# Altium project CV-R-BAP_V2.1.5.PrjPcb
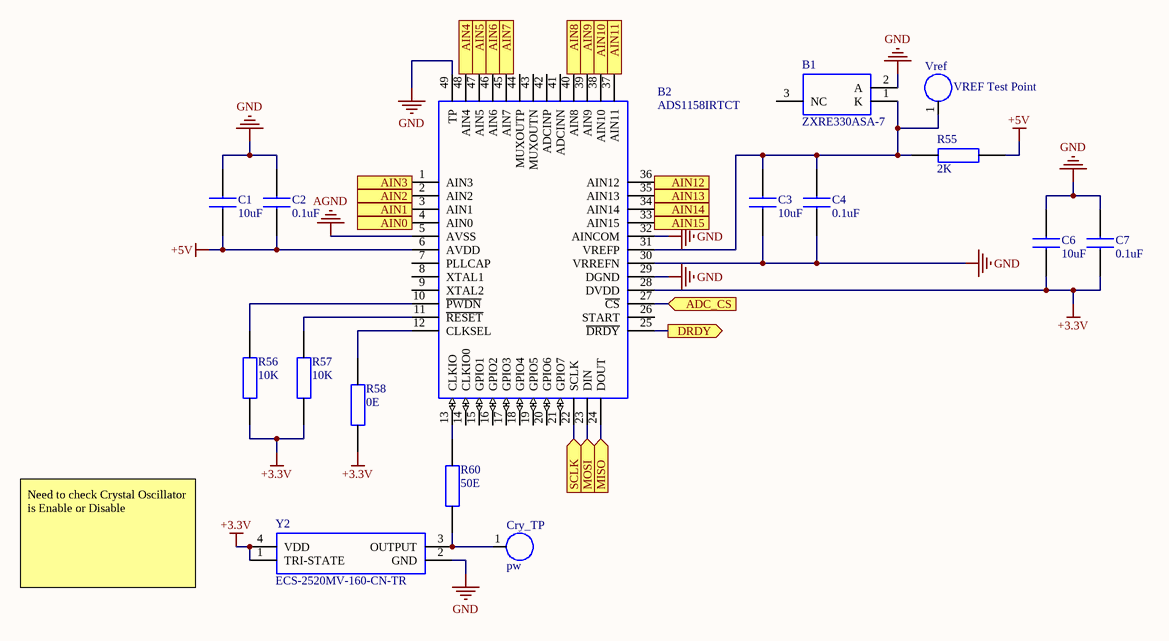
[diagram p0: ADS1158.SchDoc]
10 sheets, 156 parts. Net scope: flat (ports and power ports of the same name join across sheets).
Board file: CV-R-BAP_V2.1.5.PcbDoc
Sheets:
  ADS1158.SchDoc
  Edge_Slot_Interface.SchDoc
  CP2102.SchDoc
  ESP32.SchDoc
  External_Memory.SchDoc
  Power_Supply.SchDoc
  RTC.SchDoc
  LM334_Constant Current Source.SchDoc
  RFID_Reader.SchDoc
  Battery and ANT.SchDoc

## Sheet ADS1158.SchDoc
size A4

### Parts
B1  ZXRE330ASA-7  [SOT96P240X110-3N]
B2  ADS1158IRTCT  [QFN-48]
C1  10uF  [CAPC1608X80N]
C2  0.1uF  [CAPC1005X55N]
C3  10uF  [CAPC1608X80N]
C4  0.1uF  [CAPC1005X55N]
C6  10uF  [CAPC1608X80N]
C7  0.1uF  [CAPC1005X55N]
Cry_TP  pw  [Test Points]
R55  2K  [RESC1005X40N]
R56  10K  [RESC1005X40N]
R57  10K  [RESC1005X40N]
R58  0E  [RESC1005X40N]
R60  50E  [RESC1005X35N]
Vref  VREF Test Point  [Test Points]
Y2  ECS-2520MV-160-CN-TR  [ECS2520MV250BNTR]

### Ports
ADC_CS (in), AIN0 (in), AIN1 (in), AIN2 (in), AIN3 (in), AIN4 (in), AIN5 (in), AIN6 (in), AIN7 (in), AIN8 (in), AIN9 (in), AIN10 (in), AIN11 (in), AIN12 (in), AIN13 (in), AIN14 (in), AIN15 (in), DRDY (out), MISO (in), MOSI (in), SCLK (in)

### Nets
+3.3V: B2.28(DVDD) C6.1 C7.1 R56.1 R57.1 R58.1 Y2.1(TRI-STATE) Y2.4(VDD)
+5V: B2.6(AVDD) C1.1 C2.1 R55.2
AGND: B2.5(AVSS)
GND: B1.2(A) B2.29(DGND) B2.30(VRREFN) B2.32(AINCOM) B2.49(TP) C1.2 C2.2 C3.1 C4.1 C6.2 C7.2 Y2.2(GND)
NetB1_1: B1.1(K) B2.31(VREFP) C3.2 C4.2 R55.1 Vref.1
NetB2_1: B2.1(AIN3) ; port AIN3
NetB2_2: B2.2(AIN2) ; port AIN2
NetB2_3: B2.3(AIN1) ; port AIN1
NetB2_4: B2.4(AIN0) ; port AIN0
NetB2_10: B2.10(~{PWDN}) R56.2
NetB2_11: B2.11(~{RESET}) R57.2
NetB2_12: B2.12(CLKSEL) R58.2
NetB2_13: B2.13(CLKIO) R60.2
NetB2_22: B2.22(SCLK) ; port SCLK
NetB2_23: B2.23(DIN) ; port MOSI
NetB2_24: B2.24(DOUT) ; port MISO
NetB2_25: B2.25(~{DRDY}) ; port DRDY
NetB2_27: B2.27(~{CS}) ; port ADC_CS
NetB2_33: B2.33(AIN15) ; port AIN15
NetB2_34: B2.34(AIN14) ; port AIN14
NetB2_35: B2.35(AIN13) ; port AIN13
NetB2_36: B2.36(AIN12) ; port AIN12
NetB2_37: B2.37(AIN11) ; port AIN11
NetB2_38: B2.38(AIN10) ; port AIN10
NetB2_39: B2.39(AIN9) ; port AIN9
NetB2_40: B2.40(AIN8) ; port AIN8
NetB2_45: B2.45(AIN7) ; port AIN7
NetB2_46: B2.46(AIN6) ; port AIN6
NetB2_47: B2.47(AIN5) ; port AIN5
NetB2_48: B2.48(AIN4) ; port AIN4
NetCry_TP_1: Cry_TP.1 R60.1 Y2.3(OUTPUT)

Not connected (* = marked no-connect by the designer): B1 3(NC); B2 7(PLLCAP) 8(XTAL1) 9(XTAL2) 14(CLKIO0) 15(GPIO1) 16(GPIO2) 17(GPIO3) 18(GPIO4) 19(GPIO5) 20(GPIO6) 21(GPIO7) 26(START) 41(ADCINN) 42(ADCINP) 43(MUXOUTN) 44(MUXOUTP)

### Notes on the sheet
- Need to check Crystal Oscillator is Enable or Disable

### Library data of the parts
B1 = ZXRE330ASA-7: Diodes Inc ZXRE330ASA-7, Shunt Precision Voltage Reference 3.3V, +/-0.5%, 3-Pin SOT-23; Manufacturer_Name: Diodes Inc.; Geometry.Height: 1.1mm; Manufacturer_Part_Number: ZXRE330ASA-7; Arrow Part Number: ZXRE330ASA-7; Arrow Price/Stock: https://www.arrow.com/en/products/zxre330asa-7/diodes-incorporated; Mouser Part Number: 621-ZXRE330ASA-7; Mouser Price/Stock: https://www.mouser.co.uk/ProductDetail/Diodes-Incorporated/ZXRE330ASA-7?qs=4q%2FTN4Rqj6JkCriwoAvbDA%3D%3D; Datasheet Link: https://www.diodes.com/assets/Datasheets/ZXRE330.pdf
B2 = ADS1158IRTCT: 16-Bit, 125kSPS, 16-Ch Delta-Sigma ADC w/ Fast Channel Scan & Automatic Sequencer; Manufacturer_Name: Texas Instruments; Geometry.Height: 0.9mm; Manufacturer_Part_Number: ADS1158IRTCT; Arrow Part Number: ADS1158IRTCT; Arrow Price/Stock: https://www.arrow.com/en/products/ads1158irtct/texas-instruments; Mouser Part Number: 595-ADS1158IRTCT; Mouser Price/Stock: https://www.mouser.co.uk/ProductDetail/Texas-Instruments/ADS1158IRTCT?qs=Fn3VdHBzkcmocHRSn4DsYg%3D%3D; Datasheet Link: http://www.mouser.com/ds/2/405/ads1158-404657.pdf
C1 C3 C6 = C1608X5R1A106K080AC: TDK - C1608X5R1A106K080AC - CAP, MLCC, X5R, 10UF, 10V, 0603; Geometry.Height: 0.8mm; Manufacturer_Name: TDK; Manufacturer_Part_Number: C1608X5R1A106K080AC; Arrow Part Number: C1608X5R1A106K080AC; Arrow Price/Stock: https://www.arrow.com/en/products/c1608x5r1a106k080ac/tdk; Mouser Part Number: 810-C1608X5R1A106K; Mouser Price/Stock: https://www.mouser.co.uk/ProductDetail/TDK/C1608X5R1A106K080AC?qs=NRhsANhppD%252B2Bx3rv7OLbA%3D%3D; Datasheet Link: https://product.tdk.com/info/en/catalog/datasheets/mlcc_commercial_midvoltage_en.pdf
C2 C4 C7 = C0402C104M4RECTU: Multilayer Ceramic Capacitors MLCC - SMD/SMT 16V 0.1uF X7R 0402 20%; Manufacturer_Name: Kemet; Geometry.Height: 0.55mm; Manufacturer_Part_Number: C0402C104M4RECTU; Arrow Part Number: C0402C104M4RECTU; Arrow Price/Stock: *; Mouser Part Number: 80-C0402C104M4RECTU; Mouser Price/Stock: https://www.mouser.com/Search/Refine.aspx?Keyword=80-C0402C104M4RECTU; Datasheet Link: https://content.kemet.com/datasheets/KEM_C1002_X7R_SMD.pdf
Cry_TP Vref = Test Points
R55 = RC0402JR-072KL: RESISTOR, 0402 2K Ohms +/-5% 1/16 W; Manufacturer_Name: YAGEO (PHYCOMP); Geometry.Height: 0.4mm; Manufacturer_Part_Number: RC0402JR-072KL; Arrow Part Number: RC0402JR-072KL; Arrow Price/Stock: https://www.arrow.com/en/products/rc0402jr-072kl/yageo; Mouser Part Number: 603-RC0402JR-072KL; Mouser Price/Stock: https://www.mouser.com/Search/Refine.aspx?Keyword=603-RC0402JR-072KL; Datasheet Link: http://www.yageo.com/documents/recent/PYu-RC0402_51_RoHS_L_6_r.pdf
R56 R57 = CRCW040210K0FKED: CRCW0402 Resistor T/R 0.063W,1%,10K Vishay CRCW Series Thick Film Surface Mount Resistor 0402 Case 10k +/-1% 0.063W +/-100ppm/C; Geometry.Height: 0.4mm; Manufacturer_Name: Vishay; Manufacturer_Part_Number: CRCW040210K0FKED; Arrow Part Number: CRCW040210K0FKED; Arrow Price/Stock: https://www.arrow.com/en/products/crcw040210k0fked/vishay; Mouser Part Number: 71-CRCW0402-10K-E3; Mouser Price/Stock: https://www.mouser.co.uk/ProductDetail/Vishay-Dale/CRCW040210K0FKED?qs=rlE3Te1NifyN3e8vvxacSw%3D%3D; Datasheet Link: http://www.vishay.com/docs/20035/dcrcwe3.pdf
R58 = RC0402FR-070RL: Thick Film Resistors - SMD 0.0ohm 1%; Manufacturer_Name: YAGEO (PHYCOMP); Geometry.Height: 0.4mm; Manufacturer_Part_Number: RC0402FR-070RL; Arrow Part Number: RC0402FR-070RL; Arrow Price/Stock: https://www.arrow.com/en/products/rc0402fr-070rl/yageo; Mouser Part Number: 603-RC0402FR-070RL; Mouser Price/Stock: https://www.mouser.co.uk/ProductDetail/Yageo/RC0402FR-070RL?qs=sxZXDnvRBEhfSy4CZGX2ww%3D%3D; Datasheet Link: http://www.yageo.com/documents/recent/PYu-RC0402_51_RoHS_L_6_r.pdf
R60 = RT0402BRE0750RL: Thin Film Resistors - SMD 50 ohm 0.1% 50 ppm High-Precision; Manufacturer_Name: YAGEO (PHYCOMP); Geometry.Height: 0.35mm; Manufacturer_Part_Number: RT0402BRE0750RL; Arrow Part Number: RT0402BRE0750RL; Arrow Price/Stock: *; Mouser Part Number: 603-RT0402BRE0750RL; Mouser Price/Stock: https://www.mouser.com/Search/Refine.aspx?Keyword=603-RT0402BRE0750RL; Datasheet Link: https://componentsearchengine.com/Datasheets/1/RT0402BRE0750RL.pdf
Y2 = ECS-2520MV-160-CN-TR: Standard Clock Oscillators 16MHz 1.6-3.6 V 25ppm -40C +85C; Manufacturer_Name: ECS; Manufacturer_Part_Number: ECS-2520MV-160-CN-TR; Arrow Part Number: ECS-2520MV-160-CN-TR; Arrow Price/Stock: *; Mouser Part Number: 520-2520MV-160-CNT; Mouser Price/Stock: https://www.mouser.co.uk/ProductDetail/ECS/ECS-2520MV-160-CN-TR?qs=byeeYqUIh0MIhToPrW09tg%3D%3D; Datasheet Link: https://www.ecsxtal.com/store/pdf/ECS-2520MV.pdf

## Sheet Edge_Slot_Interface.SchDoc
size A4
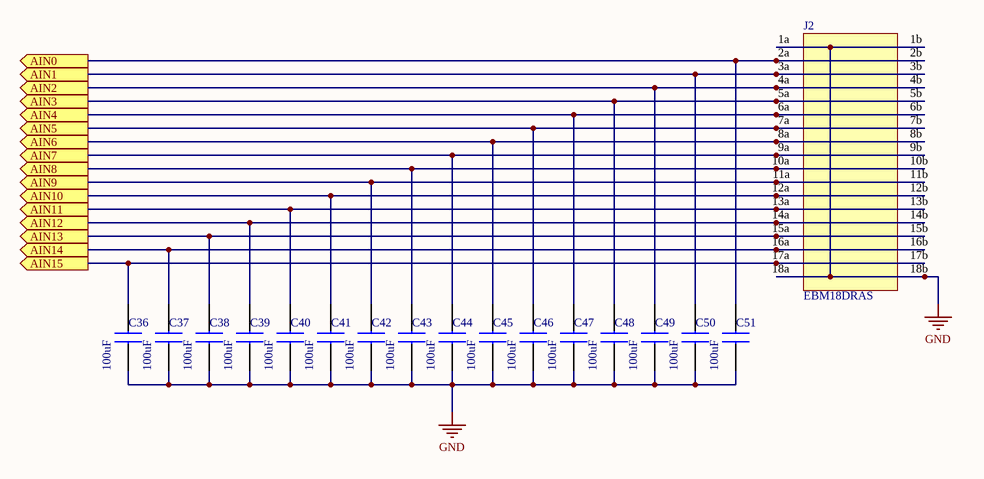
[diagram p1: Edge_Slot_Interface.SchDoc]

### Parts
C36  100uF  [Cap_0805]
C37  100uF  [Cap_0805]
C38  100uF  [Cap_0805]
C39  100uF  [Cap_0805]
C40  100uF  [Cap_0805]
C41  100uF  [Cap_0805]
C42  100uF  [Cap_0805]
C43  100uF  [Cap_0805]
C44  100uF  [Cap_0805]
C45  100uF  [Cap_0805]
C46  100uF  [Cap_0805]
C47  100uF  [Cap_0805]
C48  100uF  [Cap_0805]
C49  100uF  [Cap_0805]
C50  100uF  [Cap_0805]
C51  100uF  [Cap_0805]
J2  EBM18DRAS  [EBM18DRAS]

### Ports
AIN0 (out), AIN1 (out), AIN2 (out), AIN3 (out), AIN4 (out), AIN5 (out), AIN6 (out), AIN7 (out), AIN8 (out), AIN9 (out), AIN10 (out), AIN11 (out), AIN12 (out), AIN13 (out), AIN14 (out), AIN15 (out)

### Nets
GND: C36.1 C37.1 C38.1 C39.1 C40.1 C41.1 C42.1 C43.1 C44.1 C45.1 C46.1 C47.1 C48.1 C49.1 C50.1 C51.1 J2.1a J2.1b J2.18a J2.18b
NetB2_1: C48.2 J2.5a J2.5b ; port AIN3
NetB2_2: C49.2 J2.4a J2.4b ; port AIN2
NetB2_3: C50.2 J2.3a J2.3b ; port AIN1
NetB2_4: C51.2 J2.2a J2.2b ; port AIN0
NetB2_33: C36.2 J2.17a J2.17b ; port AIN15
NetB2_34: C37.2 J2.16a J2.16b ; port AIN14
NetB2_35: C38.2 J2.15a J2.15b ; port AIN13
NetB2_36: C39.2 J2.14a J2.14b ; port AIN12
NetB2_37: C40.2 J2.13a J2.13b ; port AIN11
NetB2_38: C41.2 J2.12a J2.12b ; port AIN10
NetB2_39: C42.2 J2.11a J2.11b ; port AIN9
NetB2_40: C43.2 J2.10a J2.10b ; port AIN8
NetB2_45: C44.2 J2.9a J2.9b ; port AIN7
NetB2_46: C45.2 J2.8a J2.8b ; port AIN6
NetB2_47: C46.2 J2.7a J2.7b ; port AIN5
NetB2_48: C47.2 J2.6a J2.6b ; port AIN4

### Library data of the parts
C36-C51 = VJ1206G106KXXTW1BC: Multilayer Ceramic Capacitors MLCC - SMD/SMT 10uF 25volts 10%; Manufacturer_Name: Vishay; Geometry.Height: 1.7mm; Manufacturer_Part_Number: VJ1206G106KXXTW1BC; Arrow Part Number: VJ1206G106KXXTW1BC; Arrow Price/Stock: *; Mouser Part Number: 77-VJ126G106KXXTW1BC; Mouser Price/Stock: https://www.mouser.co.uk/ProductDetail/Vishay-Vitramon/VJ1206G106KXXTW1BC?qs=%252BqhDFMvZazSFJ5Hhl5VYQw%3D%3D; Datasheet Link: http://www.vishay.com/docs/45200/vjhirelseries.pdf
J2 = EBM18DRAS: CONN EDGE DUAL FMALE 18POS 0.051mm dia

## Sheet CP2102.SchDoc
size A4
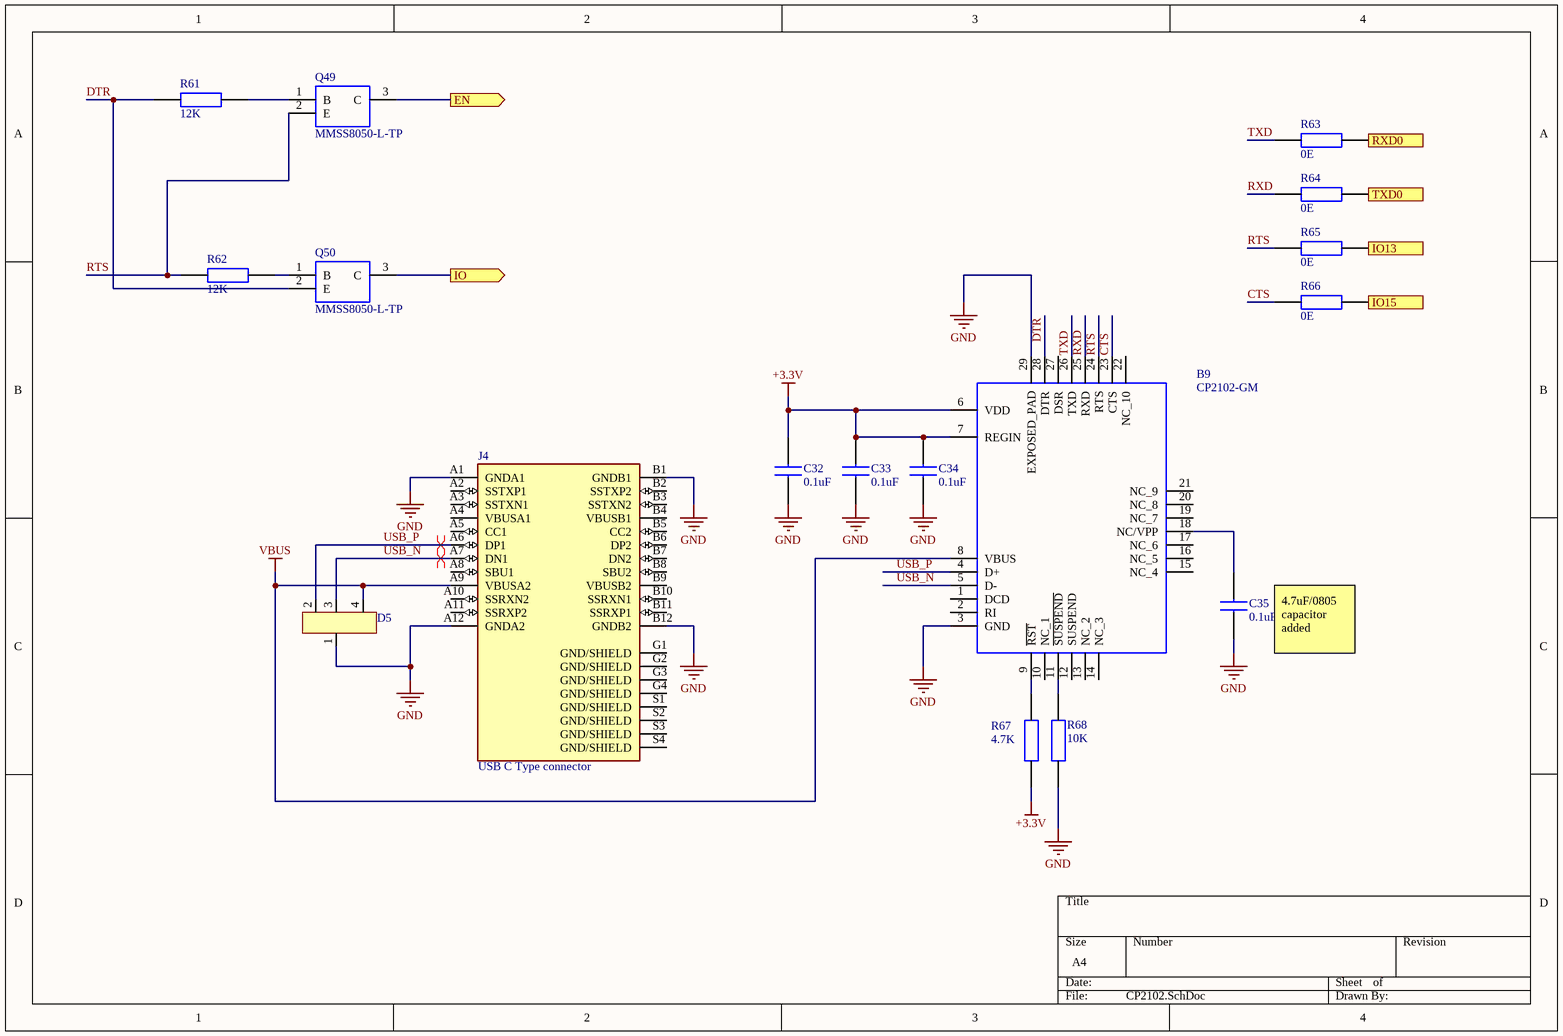
[diagram p2: CP2102.SchDoc]

### Parts
B9  CP2102-GM  [QFN-28]
C32  0.1uF  [CAPC1005X55N]
C33  0.1uF  [CAPC1005X55N]
C34  0.1uF  [CAPC1005X55N]
C35  0.1uF  [CAPC1005X55N]
D5  SP0504BAJTG_ESD Diode  [SOT-143-4]  (value not drawn)
J4  USB C Type connector  [USB C Type connector]
Q49  MMSS8050-L-TP  [SOT96P237X112-3N]
Q50  MMSS8050-L-TP  [SOT96P237X112-3N]
R61  12K  [RESC1005X40N]
R62  12K  [RESC1005X40N]
R63  0E  [RESC1005X40N]
R64  0E  [RESC1005X40N]
R65  0E  [RESC1005X40N]
R66  0E  [RESC1005X40N]
R67  4.7K  [RESC1005X40N]
R68  10K  [RESC1005X40N]

### Ports
EN (out), IO13 (out), IO15 (out), IO (out), RXD0 (out), TXD0 (in)

### Nets
+3.3V: B9.6(VDD) B9.7(REGIN) C32.2 C33.2 C34.2 R67.1
GND: B9.3(GND) B9.29(EXPOSED_PAD) C32.1 C33.1 C34.1 C35.1 D5.1 J4.A1(GNDA1) J4.A12(GNDA2) J4.B1(GNDB1) J4.B12(GNDB2) R68.1
VBUS: B9.8(VBUS) D5.4 J4.A9(VBUSA2)
CTS: B9.23(CTS) R66.1
DTR: B9.28(DTR) Q50.2(E) R61.1
RTS: B9.24(RTS) Q49.2(E) R62.1 R65.1
RXD: B9.25(RXD) R64.1
TXD: B9.26(TXD) R63.1
USB_N: B9.5(D-) D5.3 J4.A7(DN1)
USB_P: B9.4(D+) D5.2 J4.A6(DP1)
NetB4_3: Q49.3(C) ; port EN
NetB4_16: R65.2 ; port IO13
NetB4_23: R66.2 ; port IO15
NetB4_25: Q50.3(C) ; port IO
NetB4_34: R63.2 ; port RXD0
NetB4_35: R64.2 ; port TXD0
NetB9_9: B9.9(~{RST}) R67.2
NetB9_11: B9.11(~{SUSPEND}) R68.2
NetB9_18: B9.18(NC/VPP) C35.2
NetQ49_1: Q49.1(B) R61.2
NetQ50_1: Q50.1(B) R62.2

Not connected (* = marked no-connect by the designer): B9 1(DCD) 2(RI) 10(NC_1) 12(SUSPEND) 13(NC_2) 14(NC_3) 15(NC_4) 16(NC_5) 17(NC_6) 19(NC_7) 20(NC_8) 21(NC_9) 22(NC_10) 27(DSR); J4 A2(SSTXP1) A3(SSTXN1) A4(VBUSA1) A5(CC1) A8(SBU1) A10(SSRXN2) A11(SSRXP2) B2(SSTXP2) B3(SSTXN2) B4(VBUSB1) B5(CC2) B6(DP2) B7(DN2) B8(SBU2) B9(VBUSB2) B10(SSRXN1) B11(SSRXP1) G1(GND/SHIELD) G2(GND/SHIELD) G3(GND/SHIELD) G4(GND/SHIELD) S1(GND/SHIELD) S2(GND/SHIELD) S3(GND/SHIELD) S4(GND/SHIELD)

### Layout directives
differential pair: USB_N, USB_P

### Notes on the sheet
- (near C35) 4.7uF/0805 capacitor added

### Library data of the parts
B9 = CP2102-GM: CP2102-GM, USB Controller 12Mbit/s USB 2.0, 3.3 V, 28-Pin, QFN; Manufacturer_Name: Silicon Labs; Geometry.Height: 1mm; Manufacturer_Part_Number: CP2102-GM; Arrow Part Number: CP2102-GM; Arrow Price/Stock: https://www.arrow.com/en/products/cp2102-gm/silicon-labs; Mouser Part Number: 634-CP2102-GM; Mouser Price/Stock: https://www.mouser.co.uk/ProductDetail/Silicon-Labs/CP2102-GM?qs=yHCtFi5ROqJvCcyR88R4Pg%3D%3D; Datasheet Link: http://docs-emea.rs-online.com/webdocs/065a/0900766b8065a805.pdf
C32-C35 = C0402C104M4RECTU: Multilayer Ceramic Capacitors MLCC - SMD/SMT 16V 0.1uF X7R 0402 20%; Manufacturer: Kemet; Part Number: C0402C104M4RECTU; Mouser Link: *; F: *
D5 = SP0504BAJTG_ESD Diode: Part Number: SP0503BAHTG; Manufacturer: Little Fuse; Footprint Doc: SOT-143-4
J4 = USB C Type connector: Part Number: 632723100011
Q49 Q50 = MMSS8050-L-TP: Bipolar Transistors - BJT 625mW, 25V, 1500mA; Manufacturer_Name: Micro Commercial Components (MCC); Geometry.Height: 1.12mm; Manufacturer_Part_Number: MMSS8050-L-TP; Arrow Part Number: MMSS8050-L-TP; Arrow Price/Stock: https://www.arrow.com/en/products/mmss8050-l-tp/micro-commercial-components; Mouser Part Number: 833-MMSS8050-L-TP; Mouser Price/Stock: https://www.mouser.co.uk/ProductDetail/Micro-Commercial-Components-MCC/MMSS8050-L-TP?qs=FaVZESsvgnebflbaqJWJVQ%3D%3D; Datasheet Link: https://componentsearchengine.com/Datasheets/1/MMSS8050-L-TP.pdf
R61 R62 = RC0402FR-0712KL: RESISTOR, 0402 12K Ohms +/-1% 1/16 W; Manufacturer_Name: YAGEO (PHYCOMP); Geometry.Height: 0.4mm; Manufacturer_Part_Number: RC0402FR-0712KL; Arrow Part Number: RC0402FR-0712KL; Arrow Price/Stock: *; Mouser Part Number: 603-RC0402FR-0712KL; Mouser Price/Stock: https://www.mouser.com/Search/Refine.aspx?Keyword=603-RC0402FR-0712KL; Datasheet Link: http://www.yageo.com/documents/recent/PYu-RC0402_51_RoHS_L_6_r.pdf
R63-R66 = RC0402FR-070RL: as R58 on sheet ADS1158; Manufacturer_Part_Number: RC0402FR-070RL; Arrow Part Number: RC0402FR-070RL; Arrow Price/Stock: https://www.arrow.com/en/products/rc0402fr-070rl/yageo; Mouser Part Number: 603-RC0402FR-070RL; Mouser Price/Stock: https://www.mouser.co.uk/ProductDetail/Yageo/RC0402FR-070RL?qs=sxZXDnvRBEhfSy4CZGX2ww%3D%3D; Datasheet Link: http://www.yageo.com/documents/recent/PYu-RC0402_51_RoHS_L_6_r.pdf
R67 = RC0402FR-074K7L: YAGEO (PHYCOMP) - RC0402FR-074K7L - RES, THICK FILM, 4K7, 1%, 0.063W, 0402; Geometry.Height: 0.4mm; Manufacturer_Name: YAGEO (PHYCOMP); Manufacturer_Part_Number: RC0402FR-074K7L; Arrow Part Number: RC0402FR-074K7L; Arrow Price/Stock: https://www.arrow.com/en/products/rc0402fr-074k7l/yageo; Mouser Part Number: 603-RC0402FR-074K7L; Mouser Price/Stock: https://www.mouser.co.uk/ProductDetail/Yageo/RC0402FR-074K7L?qs=V1yeUXFNrkn%2FmCXC8N8TTA%3D%3D; Datasheet Link: http://www.yageo.com/documents/recent/PYu-RC0402_51_RoHS_L_6_r.pdf
R68 = RC0402JR-0710KL: YAGEO (PHYCOMP) - RC0402JR-0710KL - RES, THICK FILM, 10K, 5%, 0.0625W, 0402; Geometry.Height: 0.4mm; Manufacturer_Name: YAGEO (PHYCOMP); Manufacturer_Part_Number: RC0402JR-0710KL; Arrow Part Number: RC0402JR-0710KL; Arrow Price/Stock: *; Mouser Part Number: 603-RC0402JR-0710KL; Mouser Price/Stock: https://www.mouser.co.uk/ProductDetail/Yageo/RC0402JR-0710KL?qs=V1yeUXFNrkk4BhFptVo0Rw%3D%3D; Datasheet Link: http://www.yageo.com/documents/recent/PYu-RC0402_51_RoHS_L_6_r.pdf

## Sheet ESP32.SchDoc
size A4
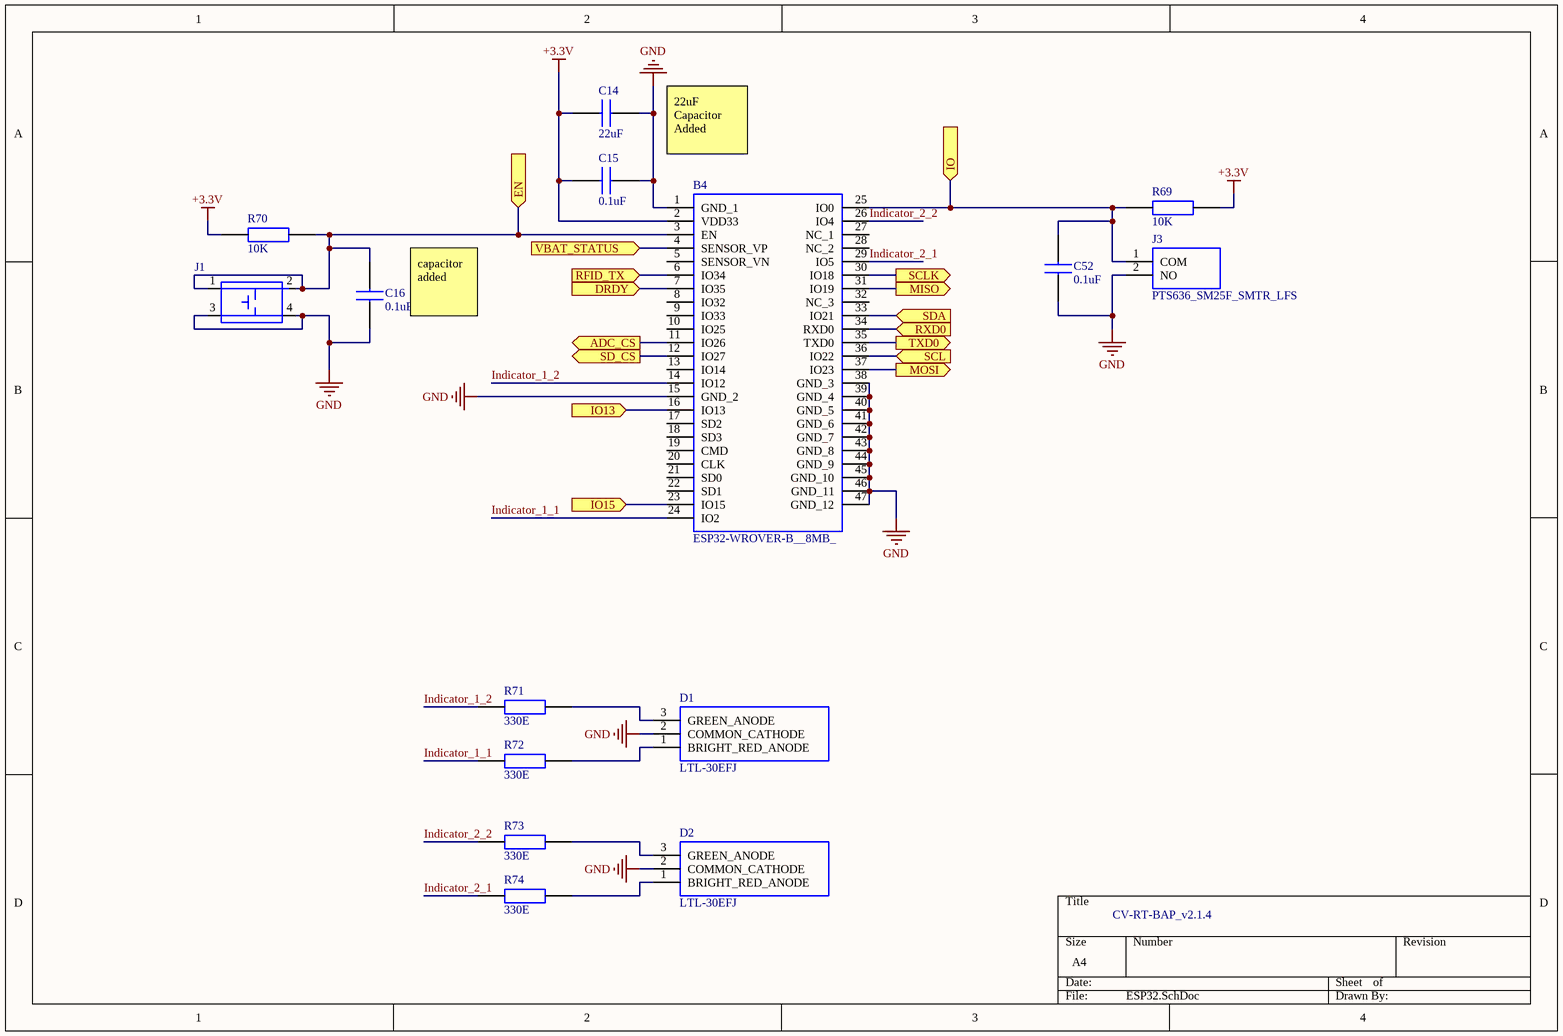
[diagram p3: ESP32.SchDoc]

### Parts
B4  ESP32-WROVER-B__8MB_  [ESP32WROVERB8MB]
C14  22uF  [CAPC3216X180N]
C15  0.1uF  [CAPC1005X55N]
C16  0.1uF  [CAPC1005X55N]
C52  0.1uF  [CAPC1005X55N]
D1  LTL-30EFJ  [LTL-30EHJ]
D2  LTL-30EFJ  [LTL-30EHJ]
J1  Tactile switch_TH  [Tactile switch_vertical]  (value not drawn)
J3  PTS636_SM25F_SMTR_LFS  [PTS636SM25FSMTRLFS]
R69  10K  [RESC1005X40N]
R70  10K  [RESC1005X40N]
R71  330E  [RESC1005X40N]
R72  330E  [RESC1005X40N]
R73  330E  [RESC1005X40N]
R74  330E  [RESC1005X40N]

### Ports
ADC_CS (out), DRDY (in), EN (in), IO13 (in), IO15 (in), IO (in), MISO (out), MOSI (out), RFID_TX (in), RXD0 (in), SCL (in), SCLK (out), SD_CS (out), SDA (in), TXD0 (out), VBAT_STATUS (in)

### Nets
+3.3V: B4.2(VDD33) C14.1 C15.1 R69.2 R70.1
GND: B4.1(GND_1) B4.15(GND_2) B4.38(GND_3) B4.39(GND_4) B4.40(GND_5) B4.41(GND_6) B4.42(GND_7) B4.43(GND_8) B4.44(GND_9) B4.45(GND_10) B4.46(GND_11) B4.47(GND_12) C14.2 C15.2 C16.1 C52.1 D1.2(COMMON_CATHODE) D2.2(COMMON_CATHODE) J1.3 J1.4 J3.2(NO)
Indicator_1_1: B4.24(IO2) R72.1
Indicator_1_2: B4.14(IO12) R71.1
Indicator_2_1: B4.29(IO5) R74.1
Indicator_2_2: B4.26(IO4) R73.1
NetB2_22: B4.30(IO18) ; port SCLK
NetB2_23: B4.37(IO23) ; port MOSI
NetB2_24: B4.31(IO19) ; port MISO
NetB2_25: B4.7(IO35) ; port DRDY
NetB2_27: B4.11(IO26) ; port ADC_CS
NetB3_5: B4.33(IO21) ; port SDA
NetB3_6: B4.36(IO22) ; port SCL
NetB4_3: B4.3(EN) C16.2 J1.1 J1.2 R70.2 ; port EN
NetB4_4: B4.4(SENSOR_VP) ; port VBAT_STATUS
NetB4_6: B4.6(IO34) ; port RFID_TX
NetB4_12: B4.12(IO27) ; port SD_CS
NetB4_16: B4.16(IO13) ; port IO13
NetB4_23: B4.23(IO15) ; port IO15
NetB4_25: B4.25(IO0) C52.2 J3.1(COM) R69.1 ; port IO
NetB4_34: B4.34(RXD0) ; port RXD0
NetB4_35: B4.35(TXD0) ; port TXD0
NetD1_1: D1.1(BRIGHT_RED_ANODE) R72.2
NetD1_3: D1.3(GREEN_ANODE) R71.2
NetD2_1: D2.1(BRIGHT_RED_ANODE) R74.2
NetD2_3: D2.3(GREEN_ANODE) R73.2

Not connected (* = marked no-connect by the designer): B4 5(SENSOR_VN) 8(IO32) 9(IO33) 10(IO25) 13(IO14) 17(SD2) 18(SD3) 19(CMD) 20(CLK) 21(SD0) 22(SD1) 27(NC_1) 28(NC_2) 32(NC_3)

### Notes on the sheet
- 22uF Capacitor Added
- (near C16) capacitor added
- CV-RT-BAP_v2.1.4

### Library data of the parts
B4 = ESP32-WROVER-B__8MB_: WiFi Modules (802.11) SMD Module M213DH6464PH3Q0, ESP32-D0WD, 64Mbits PSRAM, 8MB SPI flash, PCB Antenna; Manufacturer_Name: Espressif; Manufacturer_Part_Number: ESP32-WROVER-B (8MB); Geometry.Height: 3.4mm; Arrow Part Number: ESP32-WROVER-B (8MB); Arrow Price/Stock: *; Mouser Part Number: 356-ESP32-WRO-B(8MB); Mouser Price/Stock: *; Datasheet Link: https://eu.mouser.com/datasheet/2/891/esp32-wrover-b_datasheet_en-1384674.pdf
C14 = C0402C104M4RECTU: Multilayer Ceramic Capacitors MLCC - SMD/SMT 25V 22uF X7R 0402 20%; Manufacturer_Name: Kemet; Geometry.Height: 0.55mm; Manufacturer_Part_Number: C0402C104M4RECTU; Arrow Part Number: C0402C104M4RECTU; Arrow Price/Stock: *; Mouser Part Number: 80-C0402C104M4RECTU; Mouser Price/Stock: https://www.mouser.com/Search/Refine.aspx?Keyword=80-C0402C104M4RECTU; Datasheet Link: https://content.kemet.com/datasheets/KEM_C1002_X7R_SMD.pdf
C15 C16 C52 = C0402C104M4RECTU: as C2 on sheet ADS1158; Manufacturer_Part_Number: C0402C104M4RECTU; Arrow Part Number: C0402C104M4RECTU; Arrow Price/Stock: *; Mouser Part Number: 80-C0402C104M4RECTU; Mouser Price/Stock: https://www.mouser.com/Search/Refine.aspx?Keyword=80-C0402C104M4RECTU; Datasheet Link: https://content.kemet.com/datasheets/KEM_C1002_X7R_SMD.pdf
D1 D2 = LTL-30EFJ: Standard LEDs - Through Hole Red/Green Diffused; Manufacturer_Name: Lite-On; Manufacturer_Part_Number: LTL-30EFJ; Arrow Part Number: LTL-30EFJ; Arrow Price/Stock: https://www.arrow.com/en/products/ltl-30efj/lite-on-technology; Mouser Part Number: 859-LTL-30EFJ; Mouser Price/Stock: https://www.mouser.com/Search/Refine.aspx?Keyword=859-LTL-30EFJ; Datasheet Link: https://componentsearchengine.com/Datasheets/1/LTL-30EFJ.pdf
J1 = Tactile switch_TH: Part Number: SKHHANA010
J3 = PTS636_SM25F_SMTR_LFS: Tactile Switches Tact 50mA 12VDC, 6.0x3.5, 2.5mm H, 180gf, F leads, No ground pin, White Actuator; Manufacturer_Name: C & K COMPONENTS; Manufacturer_Part_Number: PTS636 SM25F SMTR LFS; Geometry.Height: 2.7mm; Arrow Part Number: PTS636 SM25F SMTR LFS; Arrow Price/Stock: https://www.arrow.com/en/products/pts636-sm25f-smtr-lfs/ck; Mouser Part Number: 611-PTS636SM25FSMTRL; Mouser Price/Stock: https://www.mouser.co.uk/ProductDetail/CK/PTS636-SM25F-SMTR-LFS?qs=vLWxofP3U2wcBTQSwfMFOw%3D%3D; Datasheet Link: https://ms.componentsearchengine.com/Datasheets/1/PTS636 SM25F SMTR LFS.pdf
R69 R70 = CRCW040210K0FKED: as R56 on sheet ADS1158; Manufacturer_Name: Vishay; Manufacturer_Part_Number: CRCW040210K0FKED; Arrow Part Number: CRCW040210K0FKED; Arrow Price/Stock: https://www.arrow.com/en/products/crcw040210k0fked/vishay; Mouser Part Number: 71-CRCW0402-10K-E3; Mouser Price/Stock: https://www.mouser.co.uk/ProductDetail/Vishay-Dale/CRCW040210K0FKED?qs=rlE3Te1NifyN3e8vvxacSw%3D%3D; Datasheet Link: http://www.vishay.com/docs/20035/dcrcwe3.pdf
R71-R74 = RC0402FR-07330RL: YAGEO (PHYCOMP) - RC0402FR-07330RL - RES, THICK FILM, 330R, 1%, 0.063W, 0402; Geometry.Height: 0.4mm; Manufacturer_Name: YAGEO (PHYCOMP); Manufacturer_Part_Number: RC0402FR-07330RL; Arrow Part Number: RC0402FR-07330RL; Arrow Price/Stock: https://www.arrow.com/en/products/rc0402fr-07330rl/yageo; Mouser Part Number: 603-RC0402FR-07330RL; Mouser Price/Stock: https://www.mouser.com/Search/Refine.aspx?Keyword=603-RC0402FR-07330RL; Datasheet Link: http://www.yageo.com/documents/recent/PYu-RC0402_51_RoHS_L_6_r.pdf

## Sheet External_Memory.SchDoc
size A4
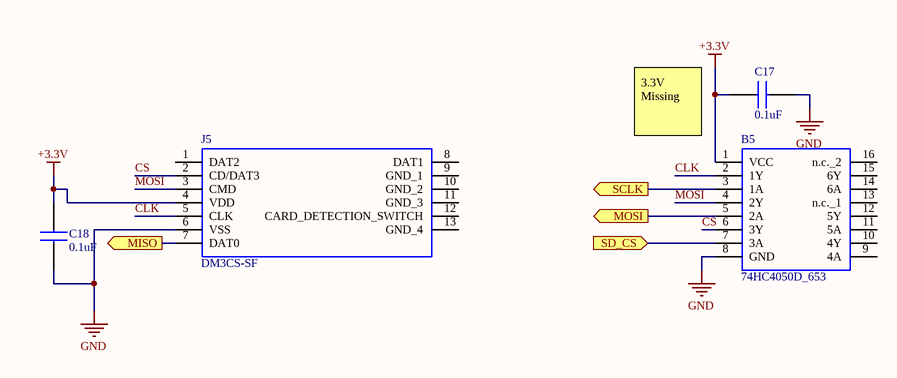
[diagram p4: External_Memory.SchDoc]

### Parts
B5  74HC4050D_653  [SOIC127P600X175-16N]
C17  0.1uF  [CAPC1005X55N]
C18  0.1uF  [CAPC1005X55N]
J5  DM3CS-SF  [DM3CS-SF]

### Ports
MISO (out), MOSI (out), SCLK (out), SD_CS (in)

### Nets
+3.3V: B5.1(VCC) C17.1 C18.2 J5.4(VDD)
GND: B5.8(GND) C17.2 C18.1 J5.6(VSS)
CLK: B5.2(1Y) J5.5(CLK)
CS: B5.6(3Y) J5.2(CD/DAT3)
MOSI: B5.4(2Y) J5.3(CMD)
NetB2_22: B5.3(1A) ; port SCLK
NetB2_23: B5.5(2A) ; port MOSI
NetB2_24: J5.7(DAT0) ; port MISO
NetB4_12: B5.7(3A) ; port SD_CS

Not connected (* = marked no-connect by the designer): B5 9(4A) 10(4Y) 11(5A) 12(5Y) 13(n.c._1) 14(6A) 15(6Y) 16(n.c._2); J5 1(DAT2) 8(DAT1) 9(GND_1) 10(GND_2) 11(GND_3) 12(CARD_DETECTION_SWITCH) 13(GND_4)

### Notes on the sheet
- 3.3V Missing

### Library data of the parts
B5 = 74HC4050D_653: 74HC4050 - Hex non-inverting HIGH-to-LOW level shifter@en-us; Manufacturer_Name: Nexperia; Manufacturer_Part_Number: 74HC4050D,653; Geometry.Height: 1.75mm; Arrow Part Number: 74HC4050D,653; Arrow Price/Stock: https://www.arrow.com/en/products/74hc4050d653/nexperia; Mouser Part Number: 771-74HC4050D-T; Mouser Price/Stock: https://www.mouser.co.uk/ProductDetail/Nexperia/74HC4050D653?qs=P62ublwmbi%2FIblpTHxAIPw%3D%3D; Datasheet Link: https://assets.nexperia.com/documents/data-sheet/74HC4050.pdf
C17 C18 = C0402C104M4RECTU: as C2 on sheet ADS1158; Manufacturer_Part_Number: C0402C104M4RECTU; Arrow Part Number: C0402C104M4RECTU; Arrow Price/Stock: *; Mouser Part Number: 80-C0402C104M4RECTU; Mouser Price/Stock: https://www.mouser.com/Search/Refine.aspx?Keyword=80-C0402C104M4RECTU; Datasheet Link: https://content.kemet.com/datasheets/KEM_C1002_X7R_SMD.pdf
J5 = DM3CS-SF: MicroSD card connector, push-pull type MicroSD card connector, push-pull type; Manufacturer_Name: Hirose; Manufacturer_Part_Number: DM3CS-SF; Arrow Part Number: DM3CS-SF; Arrow Price/Stock: https://www.arrow.com/en/products/dm3cs-sf/hirose-electric; Mouser Part Number: 798-DM3CSSF; Mouser Price/Stock: https://www.mouser.co.uk/ProductDetail/Hirose-Connector/DM3CS-SF?qs=tTj%252BmQ3KZwbB9K5zh89Rcw%3D%3D; Datasheet Link: http://docs-emea.rs-online.com/webdocs/118f/0900766b8118f8bb.pdf

## Sheet Power_Supply.SchDoc: Main_Board_v2.2_Power_Supply
size A4
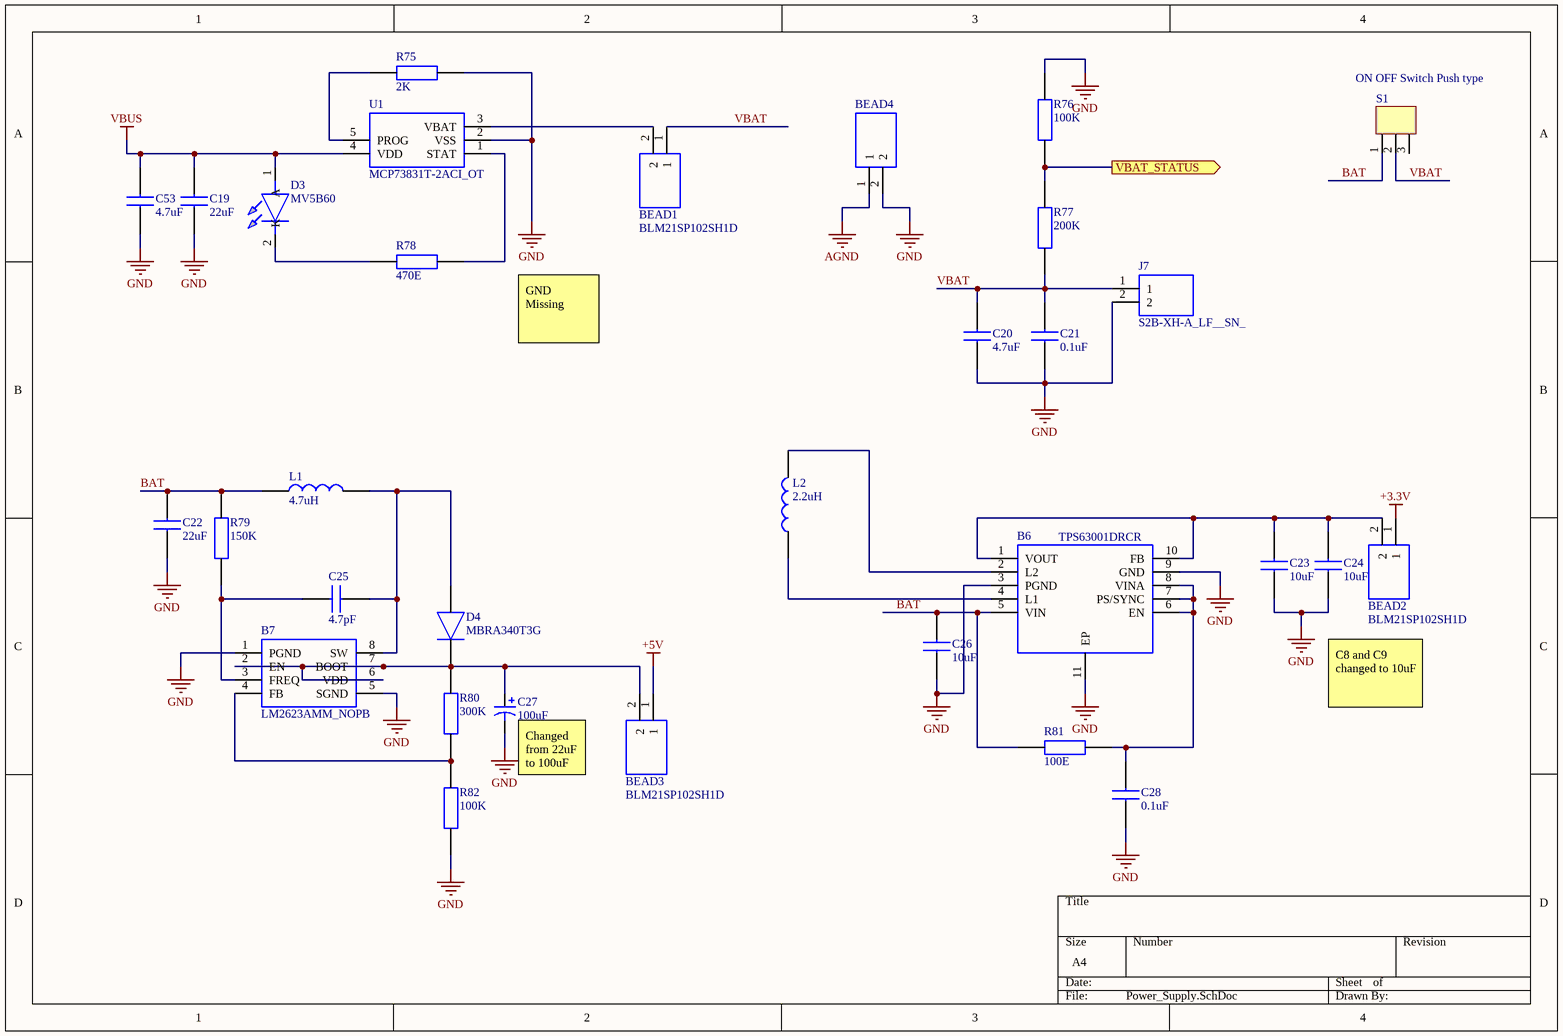
[diagram p5: Power_Supply.SchDoc]

### Parts
B6  TPS63001DRCR  [SON50P300X300X100-11N-D]
B7  LM2623AMM_NOPB  [SOP65P490X110-8N]
BEAD1  BLM21SP102SH1D  [Bead_0805]
BEAD2  BLM21SP102SH1D  [Bead_0805]
BEAD3  BLM21SP102SH1D  [Bead_0805]
BEAD4  BLM21SP102SH1D  [Bead_0805]  (value not drawn)
C19  22uF  [CAPC3216X180N]
C20  4.7uF  [CAPC2012X140N]
C21  0.1uF  [CAPC1005X55N]
C22  22uF  [CAPC3216X180N]
C23  10uF  [CAPC1608X80N]
C24  10uF  [CAPC1608X80N]
C25  4.7pF  [CAPC2012X88N]
C26  10uF  [CAPC3216X170N]
C27  value 100uF  [Tantalum Capacitor_2917]  (hidden comment: Cap Pol1)
C28  0.1uF  [CAPC1005X55N]
C53  4.7uF  [CAPC2012X140N]
D3  MV5B60  [MV5B60]
D4  MBRA340T3G  [DIOM5226X220N]
J7  S2B-XH-A_LF__SN_  [SHDRRA2W80P0X250_1X2_740X1150X610P]
L1  4.7uH  [INDC2012X140N]
L2  2.2uH  [INDC2012X140N]
R75  2K  [RESC1005X40N]
R76  100K  [RESC2012X60N]
R77  200K  [RESC2012X60N]
R78  470E  [RESC1005X40N]
R79  150K  [RESC2012X50N]
R80  300K  [RESC1005X40N]
R81  100E  [RESC1005X40N]
R82  100K  [RESC1005X40N]
S1  ON OFF Switch Push type  [SPST_Push type]
U1  MCP73831T-2ACI_OT  [SOT95P270X145-5N]

### Ports
VBAT_STATUS (out)

### Nets
+3.3V: BEAD2.1
+5V: BEAD3.1
AGND: BEAD4.1
GND: B6.3(PGND) B6.9(GND) B6.11(EP) B7.1(PGND) B7.5(SGND) BEAD4.2 C19.1 C20.1 C21.1 C22.1 C23.1 C24.1 C26.1 C27.2 C28.1 C53.1 J7.2 R75.2 R76.2 R82.1 U1.2(VSS)
VBUS: C19.2 C53.2 D3.1(A) U1.4(VDD)
BAT: B6.5(VIN) C22.2 C26.2 L1.1 R79.2 R81.2 S1.1
VBAT: BEAD1.1 C20.2 C21.2 J7.1 R77.1 S1.2
NetB4_4: R76.1 R77.2 ; port VBAT_STATUS
NetB6_1: B6.1(VOUT) B6.10(FB) BEAD2.2 C23.2 C24.2
NetB6_2: B6.2(L2) L2.2
NetB6_4: B6.4(L1) L2.1
NetB6_6: B6.6(EN) B6.7(PS/SYNC) B6.8(VINA) C28.2 R81.1
NetB7_2: B7.2(EN) B7.6(VDD) B7.7(BOOT) BEAD3.2 C27.1 D4.1(K) R80.2
NetB7_3: B7.3(FREQ) C25.1 R79.1
NetB7_4: B7.4(FB) R80.1 R82.2
NetB7_8: B7.8(SW) C25.2 D4.2(A) L1.2
NetBEAD1_2: BEAD1.2 U1.3(VBAT)
NetD3_2: D3.2(K) R78.2
NetR75_1: R75.1 U1.5(PROG)
NetR78_1: R78.1 U1.1(STAT)

Not connected (* = marked no-connect by the designer): S1 3

### Notes on the sheet
- GND  Missing
- C8 and C9 changed to 10uF
- (near C27) Changed from 22uF to 100uF Tantulum cap

### Library data of the parts
B6 = TPS63001DRCR: 96% Buck-Boost Converter with 1.7A Current Switches, 3.3V fixed Output voltage in 3x3 QFN; Manufacturer_Name: Texas Instruments; Geometry.Height: 1mm; Manufacturer_Part_Number: TPS63001DRCR; Arrow Part Number: TPS63001DRCR; Arrow Price/Stock: https://www.arrow.com/en/products/tps63001drcr/texas-instruments; Mouser Part Number: 595-TPS63001DRCR; Mouser Price/Stock: https://www.mouser.co.uk/ProductDetail/Texas-Instruments/TPS63001DRCR?qs=QZuYiDxzHagn01UZf%2F%252B1Bw%3D%3D; Datasheet Link: http://www.ti.com/lit/gpn/tps63001
B7 = LM2623AMM_NOPB: General Purpose, Gated Oscillator Based, DC/DC Boost Converter; Manufacturer_Name: Texas Instruments; Manufacturer_Part_Number: LM2623AMM/NOPB; Geometry.Height: 1.1mm; Arrow Part Number: LM2623AMM/NOPB; Arrow Price/Stock: https://www.arrow.com/en/products/lm2623ammnopb/texas-instruments; Mouser Part Number: 926-LM2623AMM/NOPB; Mouser Price/Stock: https://www.mouser.co.uk/ProductDetail/Texas-Instruments/LM2623AMM-NOPB?qs=X1J7HmVL2ZHUXFRmS%252BHhFg%3D%3D; Datasheet Link: http://www.ti.com/lit/ds/symlink/lm2623.pdf
BEAD1-BEAD4 = BLM21SP102SH1D: BLM21_H1D Series EMI Suppression Filter 1000+/-25% at 100MHz 1.6A @85; Manufacturer_Name: Murata Electronics; Geometry.Height: 1.05mm; Manufacturer_Part_Number: BLM21SP102SH1D; Arrow Part Number: BLM21SP102SH1D; Arrow Price/Stock: https://www.arrow.com/en/products/blm21sp102sh1d/murata-manufacturing; Mouser Part Number: 81-BLM21SP102SH1D; Mouser Price/Stock: https://www.mouser.co.uk/ProductDetail/Murata-Electronics/BLM21SP102SH1D?qs=17u8i%2FzlE88gxwLak368hw%3D%3D; Datasheet Link: https://www.murata.com/en-us/products/productdetail?partno=BLM21SP102SH1%23
C19 C22 = CC1206KKX7R6BB226: Multilayer Ceramic Capacitors MLCC - SMD/SMT 22uF 10% 10V; Manufacturer_Name: YAGEO (PHYCOMP); Geometry.Height: 1.8mm; Manufacturer_Part_Number: CC1206KKX7R6BB226; Arrow Part Number: CC1206KKX7R6BB226; Arrow Price/Stock: *; Mouser Part Number: 603-CC206KKX7R6BB226; Mouser Price/Stock: https://www.mouser.com/Search/Refine.aspx?Keyword=603-CC206KKX7R6BB226; Datasheet Link: https://www.mouser.com/datasheet/2/447/UPY-GPHC_X7R_6.3V-to-50V_18-1154002.pdf
C20 C53 = C0805C475J9RACAUTO: KEMET 0805 (2012M) 4.7uF MLCC 6.3V dc +/-5% SMD C0805C475J9RACAUTO; Geometry.Height: 1.4mm; Manufacturer_Name: Kemet; Manufacturer_Part_Number: C0805C475J9RACAUTO; Arrow Part Number: C0805C475J9RACAUTO; Arrow Price/Stock: https://www.arrow.com/en/products/c0805c475j9racauto/kemet-corporation; Mouser Part Number: 80-C0805C475J9RAUTO; Mouser Price/Stock: https://www.mouser.com/Search/Refine.aspx?Keyword=80-C0805C475J9RAUTO; Datasheet Link: https://api.kemet.com/component-edge/download/datasheet/C0805C475J9RACAUTO.pdf
C21 C28 = C0402C104M4RECTU: as C2 on sheet ADS1158; Manufacturer_Part_Number: C0402C104M4RECTU; Arrow Part Number: C0402C104M4RECTU; Arrow Price/Stock: *; Mouser Part Number: 80-C0402C104M4RECTU; Mouser Price/Stock: https://www.mouser.com/Search/Refine.aspx?Keyword=80-C0402C104M4RECTU; Datasheet Link: https://content.kemet.com/datasheets/KEM_C1002_X7R_SMD.pdf
C23 = C0402C104M4RECTU: CAP TANT 10UF 10% 6.3V 1206; Manufacturer_Name: Kemet; Manufacturer_Part_Number: 293D106X96R3A2TE3; Geometry.Height: 0.55mm; Arrow Part Number: C0402C104M4RECTU; Arrow Price/Stock: *; Mouser Part Number: 80-C0402C104M4RECTU; Mouser Price/Stock: https://www.mouser.com/Search/Refine.aspx?Keyword=80-C0402C104M4RECTU; Datasheet Link: https://content.kemet.com/datasheets/KEM_C1002_X7R_SMD.pdf
C24 = CC1206KKX7R6BB226: CAP TANT 10UF 10% 6.3V 1206; Manufacturer_Name: YAGEO (PHYCOMP); Manufacturer_Part_Number: 293D106X96R3A2TE3; Geometry.Height: 1.8mm; Arrow Part Number: CC1206KKX7R6BB226; Arrow Price/Stock: *; Mouser Part Number: 603-CC206KKX7R6BB226; Mouser Price/Stock: https://www.mouser.com/Search/Refine.aspx?Keyword=603-CC206KKX7R6BB226; Datasheet Link: https://www.mouser.com/datasheet/2/447/UPY-GPHC_X7R_6.3V-to-50V_18-1154002.pdf
C25 = C0805C479C2GACTU: Kemet 0805 C 4.7pF Ceramic Multilayer Capacitor, 200 V dc, +125C, C0G Dielectric, +/-0.25pF; Geometry.Height: 0.88mm; Manufacturer_Name: Kemet; Manufacturer_Part_Number: C0805C479C2GACTU; Arrow Part Number: C0805C479C2GACTU; Arrow Price/Stock: *; Mouser Part Number: 80-C0805C479C2G; Mouser Price/Stock: https://www.mouser.co.uk/ProductDetail/KEMET/C0805C479C2GACTU?qs=Kt%252B%2Fw7aCTnl%2FOadhisFOJw%3D%3D; Datasheet Link: https://search.kemet.com/component-edge/download/specsheet/C0805C479C2GACTU.pdf
C26 = VJ1206G106KXXTW1BC: as C36 on sheet Edge_Slot_Interface; Manufacturer_Part_Number: VJ1206G106KXXTW1BC; Arrow Part Number: VJ1206G106KXXTW1BC; Arrow Price/Stock: *; Mouser Part Number: 77-VJ126G106KXXTW1BC; Mouser Price/Stock: https://www.mouser.co.uk/ProductDetail/Vishay-Vitramon/VJ1206G106KXXTW1BC?qs=%252BqhDFMvZazSFJ5Hhl5VYQw%3D%3D; Datasheet Link: http://www.vishay.com/docs/45200/vjhirelseries.pdf
C27 = Cap Pol1: Polarized Capacitor (Radial); Published: 8-Jun-2000; LatestRevisionDate: 17-Jul-2002; LatestRevisionNote: Re-released for DXP Platform.; PackageReference: RB7.6-15; Publisher: Altium Limited; PackageDescription: Polarized Capacitor (Radial); 2 Leads
D3 = MV5B60: Standard LEDs - Through Hole T-100 BLUE CLEAR; Manufacturer_Name: Everlight; Manufacturer_Part_Number: MV5B60; Arrow Part Number: MV5B60; Arrow Price/Stock: *; Mouser Part Number: 638-MV5B60; Mouser Price/Stock: https://www.mouser.com/Search/Refine.aspx?Keyword=638-MV5B60; Datasheet Link: https://componentsearchengine.com/Datasheets/1/MV5B60.pdf
D4 = MBRA340T3G: MBRA340T3G, Schottky Diode,  3A max, 40V, 2-Pin, SMA; Manufacturer_Name: ON Semiconductor; Geometry.Height: 2.2mm; Manufacturer_Part_Number: MBRA340T3G; Arrow Part Number: MBRA340T3G; Arrow Price/Stock: https://www.arrow.com/en/products/mbra340t3g/on-semiconductor; Mouser Part Number: 863-MBRA340T3G; Mouser Price/Stock: https://www.mouser.co.uk/ProductDetail/ON-Semiconductor/MBRA340T3G?qs=3JMERSakebq0pjb145uRLw%3D%3D; Datasheet Link: http://www.onsemi.com/pub/Collateral/MBRA340T3-D.PDF
J7 = S2B-XH-A_LF__SN_: XH-2.5mm Header side entry 2 way JST XH Series, Series Number S2B, 2.5mm Pitch 2 Way 1 Row Right Angle PCB Header, Solder Termination, 3A; Manufacturer_Name: JST (JAPAN SOLDERLESS TERMINALS); Manufacturer_Part_Number: S2B-XH-A(LF)(SN); Geometry.Height: 6.1mm; Arrow Part Number: S2B-XH-A(LF)(SN); Arrow Price/Stock: https://www.arrow.com/en/products/s2b-xh-a-lf-sn/jst-manufacturing; Mouser Part Number: *; Mouser Price/Stock: *; Datasheet Link: http://www.jst-mfg.com/product/pdf/eng/eXH.pdf
L1 L2 = BRC2012T2R2MD: Manufacturer_Name: TAIYO YUDEN; Geometry.Height: 1.4mm; Manufacturer_Part_Number: BRC2012T2R2MD; Arrow Part Number: BRC2012T2R2MD; Arrow Price/Stock: http://www.arrow.com/en/products/brc2012t2r2md/taiyo-yuden; Mouser Part Number: 963-BRC2012T2R2MD; Mouser Price/Stock: https://www.mouser.co.uk/ProductDetail/Taiyo-Yuden/BRC2012T2R2MD?qs=I6KAKw0tg2xahQxcAJDRXw%3D%3D; Datasheet Link: https://www.mouser.com/datasheet/2/396/wound07_e-1628381.pdf
R75 = RC0402JR-072KL: as R55 on sheet ADS1158; Manufacturer_Part_Number: RC0402JR-072KL; Arrow Part Number: RC0402JR-072KL; Arrow Price/Stock: https://www.arrow.com/en/products/rc0402jr-072kl/yageo; Mouser Part Number: 603-RC0402JR-072KL; Mouser Price/Stock: https://www.mouser.com/Search/Refine.aspx?Keyword=603-RC0402JR-072KL; Datasheet Link: http://www.yageo.com/documents/recent/PYu-RC0402_51_RoHS_L_6_r.pdf
R76 = RC0805JR-072ML: Thick Film Resistors - SMD 2M OHM 5%; Manufacturer_Name: YAGEO (PHYCOMP); Geometry.Height: 0.6mm; Manufacturer_Part_Number: RC0805JR-072ML; Arrow Part Number: RC0805JR-072ML; Arrow Price/Stock: https://www.arrow.com/en/products/rc0805jr-072ml/yageo; Mouser Part Number: 603-RC0805JR-072ML; Mouser Price/Stock: https://www.mouser.com/Search/Refine.aspx?Keyword=603-RC0805JR-072ML; Datasheet Link: http://www.yageo.com/documents/recent/PYu-RC_Group_51_RoHS_L_10.pdf
R77 = RC0805FR-07806KL: Thick Film Resistors - SMD 806K OHM 1%; Manufacturer_Name: YAGEO (PHYCOMP); Geometry.Height: 0.6mm; Manufacturer_Part_Number: RC0805FR-07806KL; Arrow Part Number: RC0805FR-07806KL; Arrow Price/Stock: https://www.arrow.com/en/products/rc0805fr-07806kl/yageo; Mouser Part Number: 603-RC0805FR-07806KL; Mouser Price/Stock: https://www.mouser.com/Search/Refine.aspx?Keyword=603-RC0805FR-07806KL; Datasheet Link: http://www.yageo.com/documents/recent/PYu-RC_Group_51_RoHS_L_10.pdf
R78 = RC0402JR-13470RL: Thick Film Resistors - SMD 470 ohm 5% 50V General Purpose; Manufacturer_Name: YAGEO (PHYCOMP); Geometry.Height: 0.4mm; Manufacturer_Part_Number: RC0402JR-13470RL; Arrow Part Number: RC0402JR-13470RL; Arrow Price/Stock: https://www.arrow.com/en/products/rc0402jr-13470rl/yageo; Mouser Part Number: 603-RC0402JR-13470RL; Mouser Price/Stock: https://www.mouser.co.uk/ProductDetail/Yageo/RC0402JR-13470RL?qs=fPU49sp6fCK89krzeMh7Zw%3D%3D; Datasheet Link: http://www.yageo.com/documents/recent/PYu-RC0402_51_RoHS_L_6_r.pdf
R79 = CRCW0805150KDKTA: Thick Film Resistors - SMD 1/8watt 150Kohms .5%; Manufacturer_Name: Vishay; Geometry.Height: 0.5mm; Manufacturer_Part_Number: CRCW0805150KDKTA; Arrow Part Number: CRCW0805150KDKTA; Arrow Price/Stock: *; Mouser Part Number: 71-CRCW08051503DT; Mouser Price/Stock: *; Datasheet Link: http://www.vishay.com/docs/20035/dcrcwe3.pdf
R80 = RC0402JR-07300KL: Thick Film Resistors - SMD 300K Ohm 5% 1/16W 50 Volts; Manufacturer_Name: YAGEO (PHYCOMP); Geometry.Height: 0.4mm; Manufacturer_Part_Number: RC0402JR-07300KL; Arrow Part Number: RC0402JR-07300KL; Arrow Price/Stock: *; Mouser Part Number: 603-RC0402JR-07300KL; Mouser Price/Stock: https://www.mouser.com/Search/Refine.aspx?Keyword=603-RC0402JR-07300KL; Datasheet Link: http://www.yageo.com/documents/recent/PYu-RC0402_51_RoHS_L_6_r.pdf
R81 = RC0402FR-07100RL: YAGEO (PHYCOMP) - RC0402FR-07100RL - RES, THICK FILM, 100R, 1%, 0.0625W, 0402; Geometry.Height: 0.4mm; Manufacturer_Name: YAGEO (PHYCOMP); Manufacturer_Part_Number: RC0402FR-07100RL; Arrow Part Number: RC0402FR-07100RL; Arrow Price/Stock: https://www.arrow.com/en/products/rc0402fr-07100rl/yageo; Mouser Part Number: 603-RC0402FR-07100RL; Mouser Price/Stock: https://www.mouser.co.uk/ProductDetail/Yageo/RC0402FR-07100RL?qs=V1yeUXFNrknwaJOOZ4yDtg%3D%3D; Datasheet Link: http://www.yageo.com/documents/recent/PYu-RC0402_51_RoHS_L_6_r.pdf
R82 = RCG0402100KFKED: Thick Film Resistors - SMD .063watt 100kohms 1% 0402 100ppm; Manufacturer_Name: Vishay; Geometry.Height: 0.4mm; Manufacturer_Part_Number: RCG0402100KFKED; Arrow Part Number: RCG0402100KFKED; Arrow Price/Stock: *; Mouser Part Number: 71-RCG0402100KFKED; Mouser Price/Stock: https://www.mouser.com/Search/Refine.aspx?Keyword=71-RCG0402100KFKED; Datasheet Link: http://www.vishay.com/docs/20037/rcae3.pdf
S1 = ON OFF Switch Push type: Part Number: PN12SHNA03QE
U1 = MCP73831T-2ACI_OT: Li-Ion Charge Controller 4.2V SOT23-5; Manufacturer_Name: Microchip; Manufacturer_Part_Number: MCP73831T-2ACI/OT; Geometry.Height: 1.45mm; Arrow Part Number: MCP73831T-2ACI/OT; Arrow Price/Stock: https://www.arrow.com/en/products/mcp73831t-2aciot/microchip-technology; Mouser Part Number: 579-MCP73831T-2ACIOT; Mouser Price/Stock: https://www.mouser.co.uk/ProductDetail/Microchip-Technology/MCP73831T-2ACI-OT?qs=yUQqVecv4qvbBQBGbHx0Mw%3D%3D; Datasheet Link: http://ww1.microchip.com/downloads/en/DeviceDoc/20001984g.pdf

## Sheet RTC.SchDoc
size A4
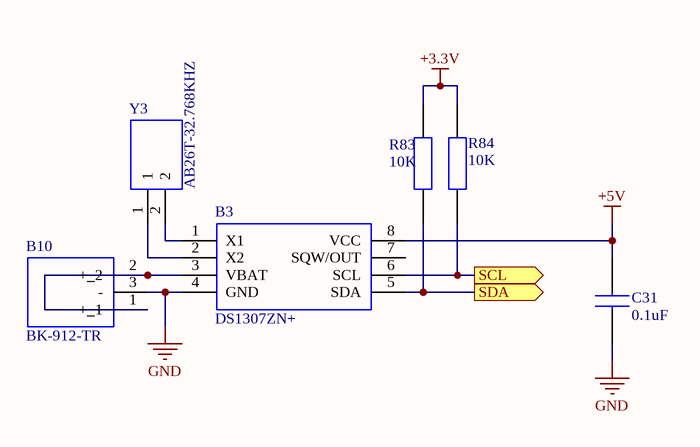
[diagram p6: RTC.SchDoc]

### Parts
B3  DS1307ZN+  [SOIC127P600X175-8N]
B10  BK-912-TR  [BK912TR]
C31  0.1uF  [CAPC1005X55N]
R83  10K  [RESC1005X40N]
R84  10K  [RESC1005X40N]
Y3  AB26T-32.768KHZ  [AB26T]

### Ports
SCL (out), SDA (out)

### Nets
+3.3V: R83.2 R84.2
+5V: B3.8(VCC) C31.2
GND: B3.4(GND) B10.3(-) C31.1
NetB3_1: B3.1(X1) Y3.2
NetB3_2: B3.2(X2) Y3.1
NetB3_3: B3.3(VBAT) B10.1(+_1) B10.2(+_2)
NetB3_5: B3.5(SDA) R83.1 ; port SDA
NetB3_6: B3.6(SCL) R84.1 ; port SCL

Not connected (* = marked no-connect by the designer): B3 7(SQW/OUT)

### Library data of the parts
B3 = DS1307ZN+: DS1307ZN+, Real Time Clock, Calendar, Clock, 56B RAM, I2C, 8-Pin SOIC; Manufacturer_Name: Maxim Integrated; Geometry.Height: 1.75mm; Manufacturer_Part_Number: DS1307ZN+; Arrow Part Number: DS1307ZN+; Arrow Price/Stock: *; Mouser Part Number: 700-DS1307ZN; Mouser Price/Stock: https://www.mouser.co.uk/ProductDetail/Maxim-Integrated/DS1307ZN%2b?qs=0Y9aZN%252BMVCXLWsJnSCEZfw%3D%3D; Datasheet Link: https://datasheets.maximintegrated.com/en/ds/DS1307.pdf
B10 = BK-912-TR: BATTERY RETAINER COIN 20MM SMD; Manufacturer_Name: MPD (Memory Protection Devices); Geometry.Height: 4.32mm; Manufacturer_Part_Number: BK-912-TR; Arrow Part Number: BK-912-TR; Arrow Price/Stock: *; Mouser Part Number: *; Mouser Price/Stock: *; Datasheet Link: https://www.memoryprotectiondevices.com/datasheets/BK-912-datasheet.pdf
C31 = C0402C104M4RECTU: as C2 on sheet ADS1158; Manufacturer_Part_Number: C0402C104M4RECTU; Arrow Part Number: C0402C104M4RECTU; Arrow Price/Stock: *; Mouser Part Number: 80-C0402C104M4RECTU; Mouser Price/Stock: https://www.mouser.com/Search/Refine.aspx?Keyword=80-C0402C104M4RECTU; Datasheet Link: https://content.kemet.com/datasheets/KEM_C1002_X7R_SMD.pdf
R83 R84 = RC0402JR-0710KL: as R68 on sheet CP2102; Manufacturer_Name: YAGEO (PHYCOMP); Manufacturer_Part_Number: RC0402JR-0710KL; Arrow Part Number: RC0402JR-0710KL; Arrow Price/Stock: *; Mouser Part Number: 603-RC0402JR-0710KL; Mouser Price/Stock: https://www.mouser.co.uk/ProductDetail/Yageo/RC0402JR-0710KL?qs=V1yeUXFNrkk4BhFptVo0Rw%3D%3D; Datasheet Link: http://www.yageo.com/documents/recent/PYu-RC0402_51_RoHS_L_6_r.pdf
Y3 = AB26T-32.768KHZ: Crystal 32.768kHz, +/-20ppm Cylindrical Can, Radial, 2.1 x 6.2mm; Manufacturer_Name: ABRACON; Manufacturer_Part_Number: AB26T-32.768KHZ; Arrow Part Number: AB26T-32.768KHZ; Arrow Price/Stock: https://www.arrow.com/en/products/ab26t-32.768khz/abracon; Mouser Part Number: 815-AB26T-32.768KHZ; Mouser Price/Stock: https://www.mouser.co.uk/ProductDetail/ABRACON/AB26T-32768KHZ?qs=m%252BUhWDcpCfZq%2FBFfwzExYQ%3D%3D; Datasheet Link: https://abracon.com/Resonators/AB26T.pdf

## Sheet LM334_Constant Current Source.SchDoc
size A4
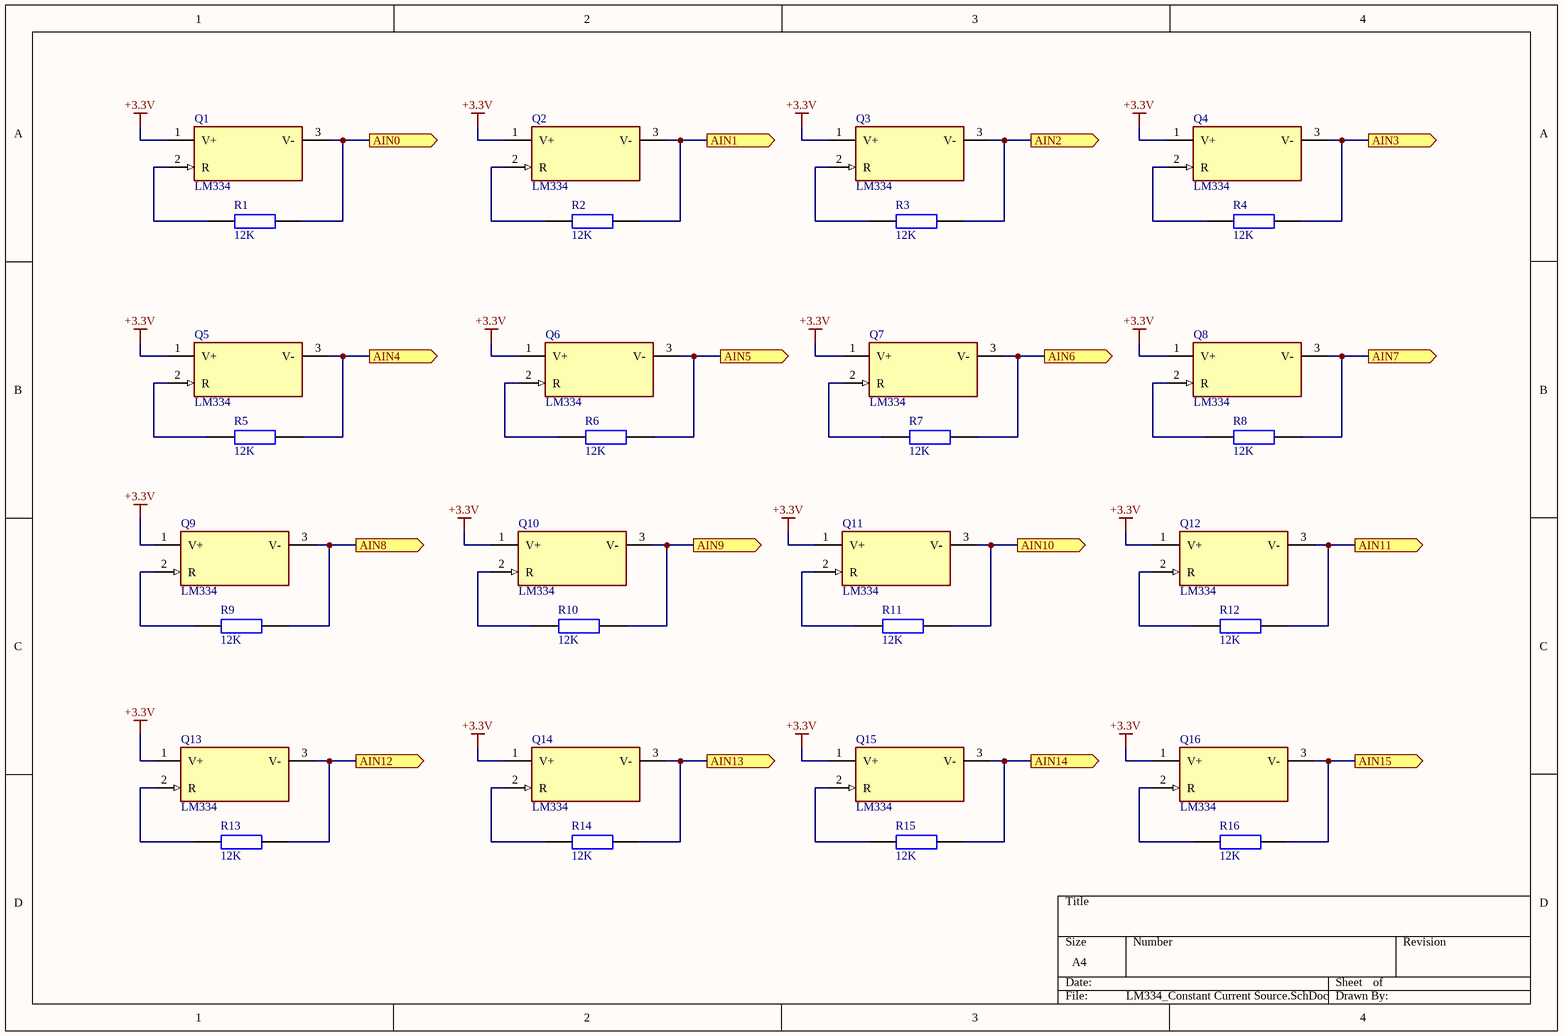
[diagram p7: LM334_Constant Current Source.SchDoc]

### Parts
Q1  LM334  [LM334_TO-92]
Q2  LM334  [LM334_TO-92]
Q3  LM334  [LM334_TO-92]
Q4  LM334  [LM334_TO-92]
Q5  LM334  [LM334_TO-92]
Q6  LM334  [LM334_TO-92]
Q7  LM334  [LM334_TO-92]
Q8  LM334  [LM334_TO-92]
Q9  LM334  [LM334_TO-92]
Q10  LM334  [LM334_TO-92]
Q11  LM334  [LM334_TO-92]
Q12  LM334  [LM334_TO-92]
Q13  LM334  [LM334_TO-92]
Q14  LM334  [LM334_TO-92]
Q15  LM334  [LM334_TO-92]
Q16  LM334  [LM334_TO-92]
R1  12K  [RESC1608X55N]
R2  12K  [RESC1608X55N]
R3  12K  [RESC1608X55N]
R4  12K  [RESC1608X55N]
R5  12K  [RESC1608X55N]
R6  12K  [RESC1608X55N]
R7  12K  [RESC1608X55N]
R8  12K  [RESC1608X55N]
R9  12K  [RESC1608X55N]
R10  12K  [RESC1608X55N]
R11  12K  [RESC1608X55N]
R12  12K  [RESC1608X55N]
R13  12K  [RESC1608X55N]
R14  12K  [RESC1608X55N]
R15  12K  [RESC1608X55N]
R16  12K  [RESC1608X55N]

### Ports
AIN0 (out), AIN1 (out), AIN2 (out), AIN3 (out), AIN4 (out), AIN5 (out), AIN6 (out), AIN7 (out), AIN8 (out), AIN9 (out), AIN10 (out), AIN11 (out), AIN12 (out), AIN13 (out), AIN14 (out), AIN15 (out)

### Nets
+3.3V: Q1.1(V+) Q2.1(V+) Q3.1(V+) Q4.1(V+) Q5.1(V+) Q6.1(V+) Q7.1(V+) Q8.1(V+) Q9.1(V+) Q10.1(V+) Q11.1(V+) Q12.1(V+) Q13.1(V+) Q14.1(V+) Q15.1(V+) Q16.1(V+)
NetB2_1: Q4.3(V-) R4.1 ; port AIN3
NetB2_2: Q3.3(V-) R3.1 ; port AIN2
NetB2_3: Q2.3(V-) R2.1 ; port AIN1
NetB2_4: Q1.3(V-) R1.1 ; port AIN0
NetB2_33: Q16.3(V-) R16.1 ; port AIN15
NetB2_34: Q15.3(V-) R15.1 ; port AIN14
NetB2_35: Q14.3(V-) R14.1 ; port AIN13
NetB2_36: Q13.3(V-) R13.1 ; port AIN12
NetB2_37: Q12.3(V-) R12.1 ; port AIN11
NetB2_38: Q11.3(V-) R11.1 ; port AIN10
NetB2_39: Q10.3(V-) R10.1 ; port AIN9
NetB2_40: Q9.3(V-) R9.1 ; port AIN8
NetB2_45: Q8.3(V-) R8.1 ; port AIN7
NetB2_46: Q7.3(V-) R7.1 ; port AIN6
NetB2_47: Q6.3(V-) R6.1 ; port AIN5
NetB2_48: Q5.3(V-) R5.1 ; port AIN4
NetQ1_2: Q1.2(R) R1.2
NetQ2_2: Q2.2(R) R2.2
NetQ3_2: Q3.2(R) R3.2
NetQ4_2: Q4.2(R) R4.2
NetQ5_2: Q5.2(R) R5.2
NetQ6_2: Q6.2(R) R6.2
NetQ7_2: Q7.2(R) R7.2
NetQ8_2: Q8.2(R) R8.2
NetQ9_2: Q9.2(R) R9.2
NetQ10_2: Q10.2(R) R10.2
NetQ11_2: Q11.2(R) R11.2
NetQ12_2: Q12.2(R) R12.2
NetQ13_2: Q13.2(R) R13.2
NetQ14_2: Q14.2(R) R14.2
NetQ15_2: Q15.2(R) R15.2
NetQ16_2: Q16.2(R) R16.2

### Library data of the parts
R1-R16 = RC0603FR-07330RL: YAGEO (PHYCOMP) - RC0603FR-0712KL - RES, THICK FILM, 12K, 1%, 0.1W, 0603
Q1-Q16 = LM334: Part Number: LM334; Footprint Doc: TO-92

## Sheet RFID_Reader.SchDoc
size A4
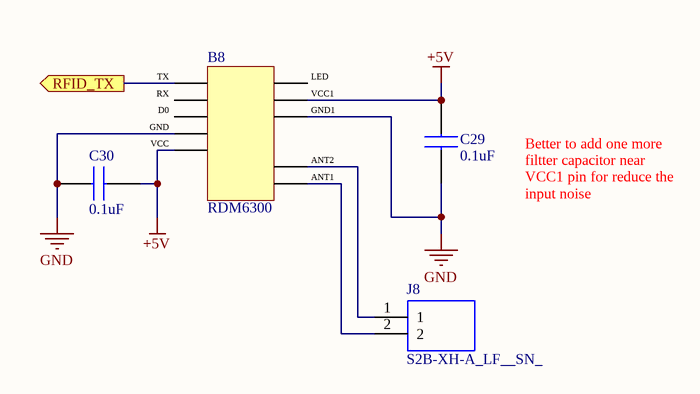
[diagram p8: RFID_Reader.SchDoc]

### Parts
B8  RDM6300  [RDM6300]
C29  0.1uF  [CAPC1005X55N]
C30  0.1uF  [CAPC1005X55N]
J8  S2B-XH-A_LF__SN_  [SHDRRA2W80P0X250_1X2_740X1150X610P]

### Ports
RFID_TX (out)

### Nets
+5V: B8.VCC B8.VCC1 C29.1 C30.2
GND: B8.GND B8.GND1 C29.2 C30.1
NetB4_6: B8.TX ; port RFID_TX
NetB8_ANT1: B8.ANT1 J8.2
NetB8_ANT2: B8.ANT2 J8.1

Not connected (* = marked no-connect by the designer): B8 D0 LED RX

### Notes on the sheet
- Better to add one more filtter capacitor near VCC1 pin for reduce the input noise

### Library data of the parts
B8 = RDM6300: RFID READER R/W 125KHZ MODULE
C29 = C0402C104M4RECTU: CAP CER 0.1UF 6.3V X7R 0402; Manufacturer_Name: Kemet; Manufacturer_Part_Number: 0402B104K6R3CT; Geometry.Height: 0.55mm; Arrow Part Number: 0402B104K6R3CT; Arrow Price/Stock: *; Mouser Part Number: 80-C0402C104M4RECTU; Mouser Price/Stock: https://www.mouser.com/Search/Refine.aspx?Keyword=80-C0402C104M4RECTU; Datasheet Link: https://content.kemet.com/datasheets/KEM_C1002_X7R_SMD.pdf
C30 = C0402C104M4RECTU: as C2 on sheet ADS1158; Manufacturer_Part_Number: C0402C104M4RECTU; Arrow Part Number: C0402C104M4RECTU; Arrow Price/Stock: *; Mouser Part Number: 80-C0402C104M4RECTU; Mouser Price/Stock: https://www.mouser.com/Search/Refine.aspx?Keyword=80-C0402C104M4RECTU; Datasheet Link: https://content.kemet.com/datasheets/KEM_C1002_X7R_SMD.pdf
J8 = S2B-XH-A_LF__SN_: as J7 on sheet Power_Supply; Arrow Part Number: S2B-XH-A(LF)(SN); Arrow Price/Stock: https://www.arrow.com/en/products/s2b-xh-a-lf-sn/jst-manufacturing; Mouser Part Number: *; Mouser Price/Stock: *; Datasheet Link: http://www.jst-mfg.com/product/pdf/eng/eXH.pdf

## Sheet Battery and ANT.SchDoc
size A4
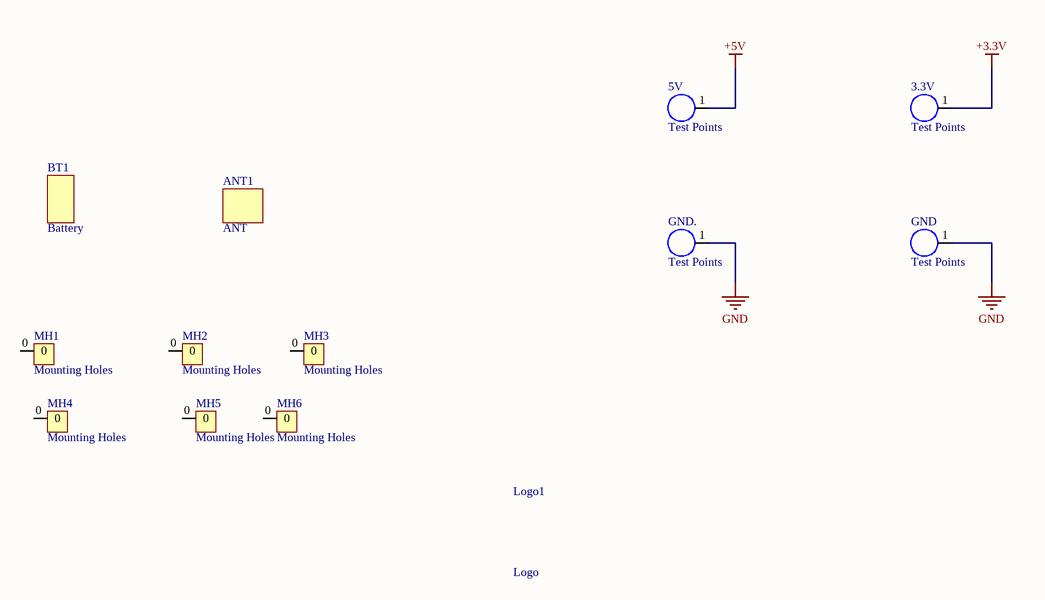
[diagram p9: Battery and ANT.SchDoc]

### Parts
3.3V  Test Points  [Test Points]
5V  Test Points  [Test Points]
ANT1  ANT  [RFID_ANT]
BT1  Battery  [Lipo_Battery]
GND  Test Points  [Test Points]
GND.  Test Points  [Test Points]
Logo1  Logo  [Logo]
MH1  Mounting Holes  [PCBComponent_1]
MH2  Mounting Holes  [PCBComponent_1]
MH3  Mounting Holes  [PCBComponent_1]
MH4  Mounting Holes  [PCBComponent_1]
MH5  Mounting Holes  [PCBComponent_1]
MH6  Mounting Holes  [PCBComponent_1]

### Nets
+3.3V: 3.3V.1
+5V: 5V.1
GND: GND.1 GND..1

Not connected (* = marked no-connect by the designer): MH1 0; MH2 0; MH3 0; MH4 0; MH5 0; MH6 0

## Nets that join several sheets
+3.3V: ADS1158 (8 pins), CP2102 (6 pins), ESP32 (5 pins), External_Memory (B5.1 C17.1 C18.2 J5.4), Power_Supply (BEAD2.1), RTC (R83.2 R84.2), LM334_Constant Current Source (16 pins), Battery and ANT (3.3V.1)
+5V: ADS1158 (B2.6 C1.1 C2.1 R55.2), Power_Supply (BEAD3.1), RTC (B3.8 C31.2), RFID_Reader (B8.VCC B8.VCC1 C29.1 C30.2), Battery and ANT (5V.1)
AGND: ADS1158 (B2.5), Power_Supply (BEAD4.1)
GND: ADS1158 (12 pins), Edge_Slot_Interface (20 pins), CP2102 (12 pins), ESP32 (21 pins), External_Memory (B5.8 C17.2 C18.1 J5.6), Power_Supply (21 pins), RTC (B3.4 B10.3 C31.1), RFID_Reader (B8.GND B8.GND1 C29.2 C30.1), Battery and ANT (GND.1 GND..1)
VBUS: CP2102 (B9.8 D5.4 J4.A9), Power_Supply (C19.2 C53.2 D3.1 U1.4)
NetB2_1: ADS1158 (B2.1), Edge_Slot_Interface (C48.2 J2.5a J2.5b), LM334_Constant Current Source (Q4.3 R4.1)
NetB2_2: ADS1158 (B2.2), Edge_Slot_Interface (C49.2 J2.4a J2.4b), LM334_Constant Current Source (Q3.3 R3.1)
NetB2_3: ADS1158 (B2.3), Edge_Slot_Interface (C50.2 J2.3a J2.3b), LM334_Constant Current Source (Q2.3 R2.1)
NetB2_4: ADS1158 (B2.4), Edge_Slot_Interface (C51.2 J2.2a J2.2b), LM334_Constant Current Source (Q1.3 R1.1)
NetB2_22: ADS1158 (B2.22), ESP32 (B4.30), External_Memory (B5.3)
NetB2_23: ADS1158 (B2.23), ESP32 (B4.37), External_Memory (B5.5)
NetB2_24: ADS1158 (B2.24), ESP32 (B4.31), External_Memory (J5.7)
NetB2_25: ADS1158 (B2.25), ESP32 (B4.7)
NetB2_27: ADS1158 (B2.27), ESP32 (B4.11)
NetB2_33: ADS1158 (B2.33), Edge_Slot_Interface (C36.2 J2.17a J2.17b), LM334_Constant Current Source (Q16.3 R16.1)
NetB2_34: ADS1158 (B2.34), Edge_Slot_Interface (C37.2 J2.16a J2.16b), LM334_Constant Current Source (Q15.3 R15.1)
NetB2_35: ADS1158 (B2.35), Edge_Slot_Interface (C38.2 J2.15a J2.15b), LM334_Constant Current Source (Q14.3 R14.1)
NetB2_36: ADS1158 (B2.36), Edge_Slot_Interface (C39.2 J2.14a J2.14b), LM334_Constant Current Source (Q13.3 R13.1)
NetB2_37: ADS1158 (B2.37), Edge_Slot_Interface (C40.2 J2.13a J2.13b), LM334_Constant Current Source (Q12.3 R12.1)
NetB2_38: ADS1158 (B2.38), Edge_Slot_Interface (C41.2 J2.12a J2.12b), LM334_Constant Current Source (Q11.3 R11.1)
NetB2_39: ADS1158 (B2.39), Edge_Slot_Interface (C42.2 J2.11a J2.11b), LM334_Constant Current Source (Q10.3 R10.1)
NetB2_40: ADS1158 (B2.40), Edge_Slot_Interface (C43.2 J2.10a J2.10b), LM334_Constant Current Source (Q9.3 R9.1)
NetB2_45: ADS1158 (B2.45), Edge_Slot_Interface (C44.2 J2.9a J2.9b), LM334_Constant Current Source (Q8.3 R8.1)
NetB2_46: ADS1158 (B2.46), Edge_Slot_Interface (C45.2 J2.8a J2.8b), LM334_Constant Current Source (Q7.3 R7.1)
NetB2_47: ADS1158 (B2.47), Edge_Slot_Interface (C46.2 J2.7a J2.7b), LM334_Constant Current Source (Q6.3 R6.1)
NetB2_48: ADS1158 (B2.48), Edge_Slot_Interface (C47.2 J2.6a J2.6b), LM334_Constant Current Source (Q5.3 R5.1)
NetB3_5: ESP32 (B4.33), RTC (B3.5 R83.1)
NetB3_6: ESP32 (B4.36), RTC (B3.6 R84.1)
NetB4_3: CP2102 (Q49.3), ESP32 (5 pins)
NetB4_4: ESP32 (B4.4), Power_Supply (R76.1 R77.2)
NetB4_6: ESP32 (B4.6), RFID_Reader (B8.TX)
NetB4_12: ESP32 (B4.12), External_Memory (B5.7)
NetB4_16: CP2102 (R65.2), ESP32 (B4.16)
NetB4_23: CP2102 (R66.2), ESP32 (B4.23)
NetB4_25: CP2102 (Q50.3), ESP32 (B4.25 C52.2 J3.1 R69.1)
NetB4_34: CP2102 (R63.2), ESP32 (B4.34)
NetB4_35: CP2102 (R64.2), ESP32 (B4.35)